# EAGLE design OSO-MISC-21-015 Temperature and Light Board (EAGLE 9.6.2)
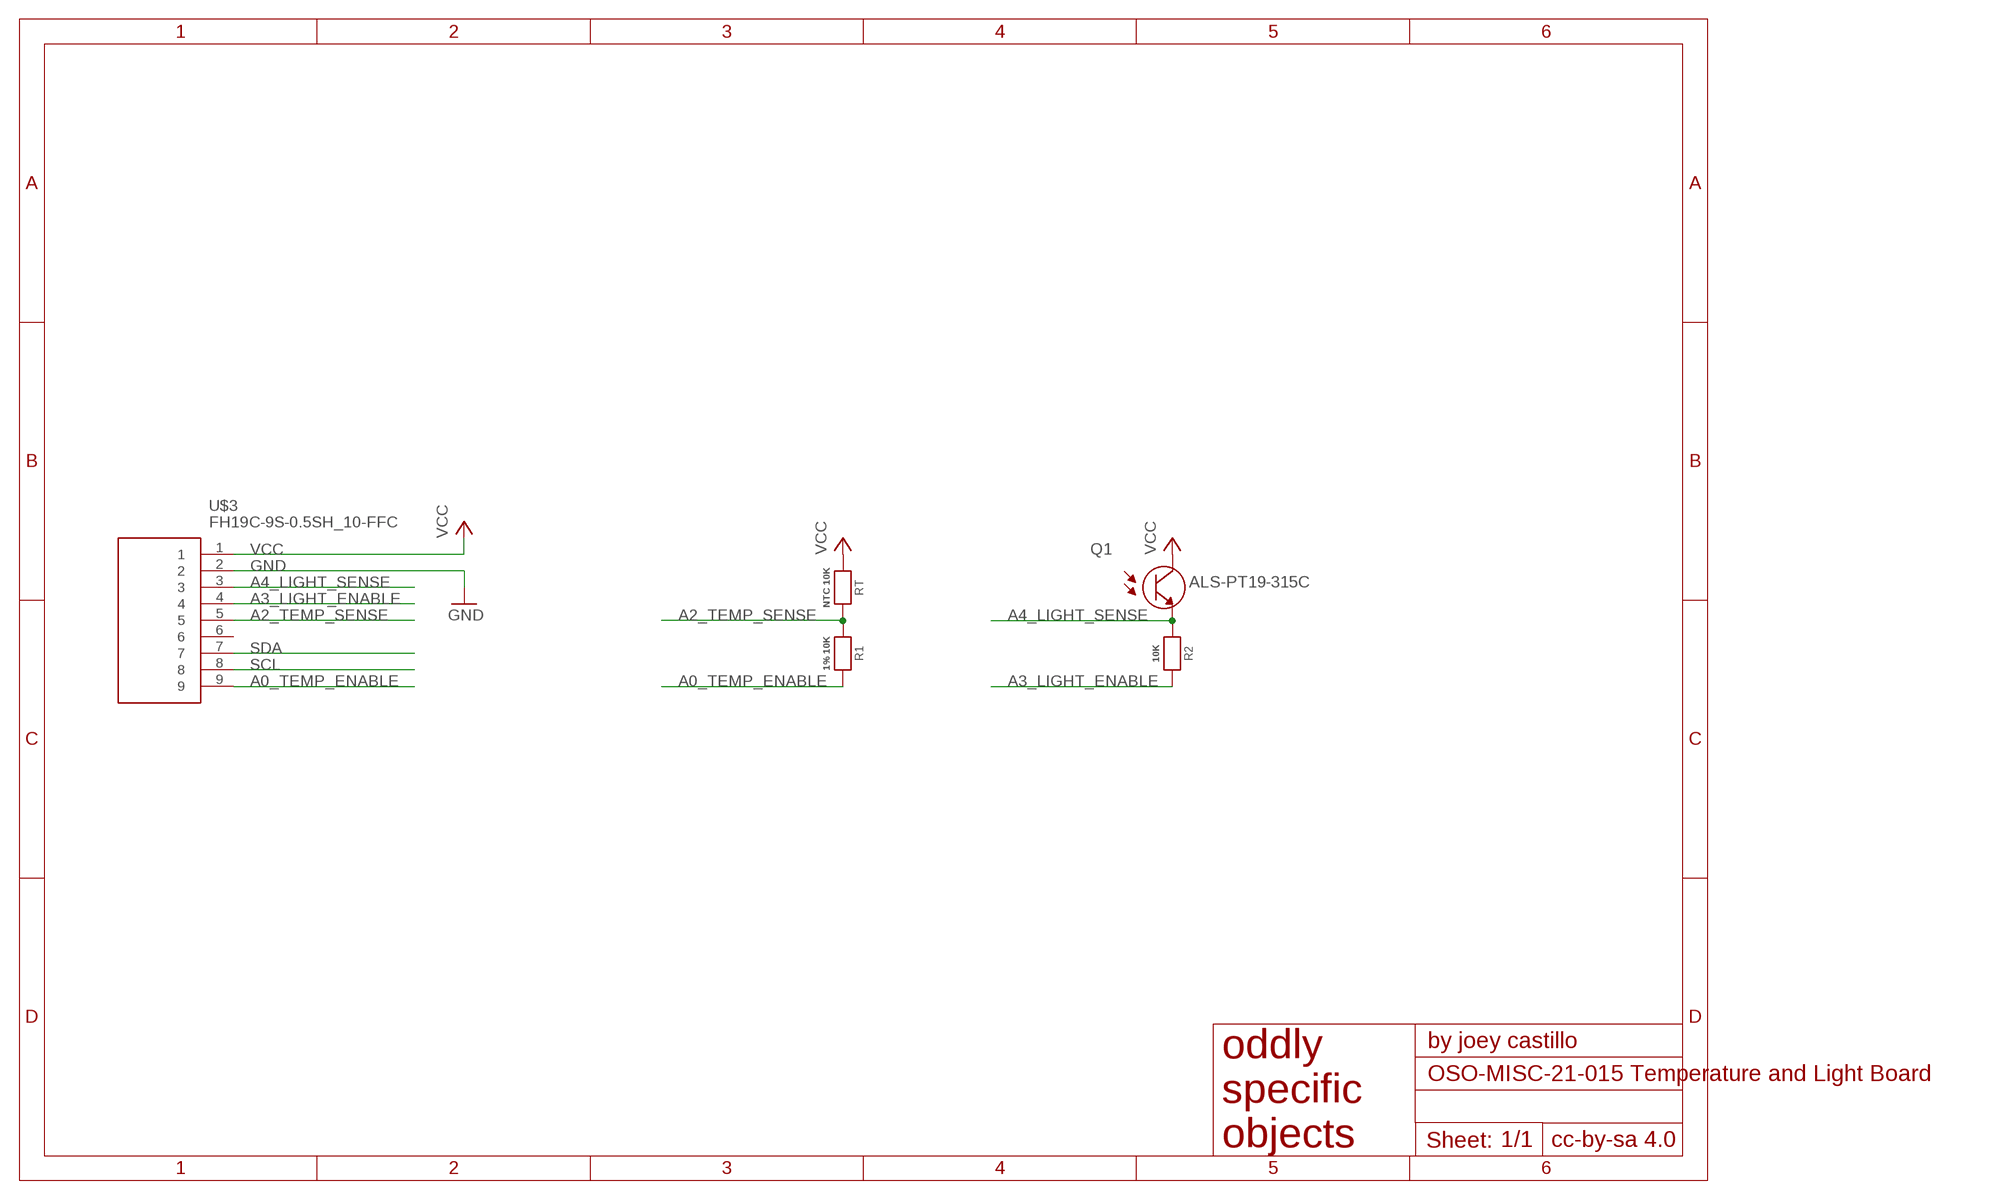
[diagram p0: schematic, sheet 1]

## Parts
Q1  ALS-PT19-315C  ALS-PT19-315C/L177/TR8REVERSEMOUNT  [XDCR_ALS-PT19-315C/L177/TR8_REVERSE]
R1  1% 10K  RESISTOR_0603MP  [_0603MP]
R2  10K  RESISTOR_0603MP  [_0603MP]
RT  NTC 10K  RESISTOR_0603  [_0603]
U$3  FH19C-9S-0.5SH_10-FFC  [FH19C9S05SH10-FFC]

## Nets
A0_TEMP_ENABLE: R1.2 U$3.9
A2_TEMP_SENSE: R1.1 RT.2 U$3.5
A3_LIGHT_ENABLE: R2.2 U$3.4
A4_LIGHT_SENSE: Q1.2(E) R2.1 U$3.3
GND [gnd]: U$3.2
SCL: U$3.8
SDA: U$3.7
VCC [power]: Q1.1(C) RT.1 U$3.1
Unconnected: U$3.6

## Library data of the parts
Q1 = ALS-PT19-315C_L177_TR8:ALS-PT19-315C/L177/TR8: Phototransistors 630nm 2-SMD, No Lead
R1 R2 RT = microbuilder:RESISTOR: Resistors For new designs, use the packages preceded by an '_' character since they are more reliable: The following footprints should be used on most boards: _0402 - Standard footprint for regular board layouts _0603 - Standard footprint for regular board layouts _0805 - Standard footprint for regular board layouts _1206 - Standard footprint for regular board layouts For extremely tight-pitch boards where space is at a premium, the following 'micro-pitch' footprints can be used (smaller pads, no silkscreen outline, etc.): _0402MP - Micro-pitch footprint for very dense/compact boards _0603MP - Micro-pitch footprint for very dense/compact boards _0805MP - Micro-pitch footprint for very dense/compact boards _1206MP - Micro-pitch footprint for very dense/compact boards
U$3 = FH19C-9S-0.5SH:FH19C-9S-0.5SH_10-FFC

## Net classes
0 default: width 0.203 mm
1 power: width 0.203 mm
2 gnd: width 0.203 mm

## Board
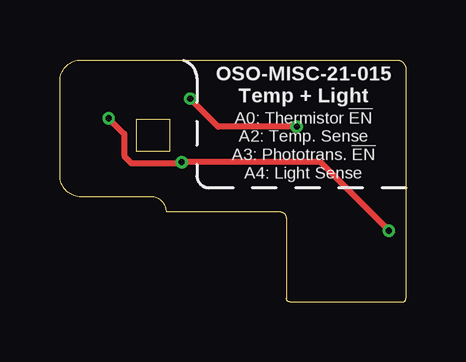
[diagram p1: board, top side]
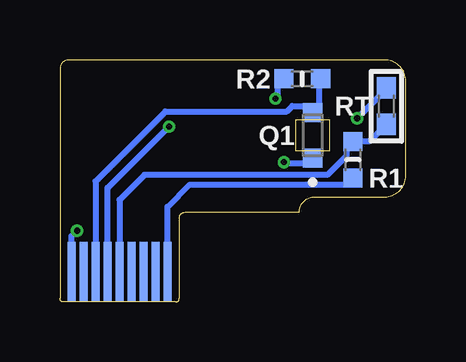
[diagram p2: board, bottom side, seen from below]

Size 14.43 x 10.1 mm. Coordinates in mm from the lower left corner, seen from the top.
Outline: 9.45,3.5 arc90 9.2,3.75 4.45,3.75 arc90 3.81,4.39 0.89,4.39 arc-90 0,5.28 0,9.21 arc-90 0.89,10.1 14.05,10.1 arc-90 14.43,9.72 14.43,3.5
Copper layers (1*16): Top 0.035559375mm / dielectric 1.6mm / Bottom 0.035559375mm
Design rules "oshpark-2layer *": minimum track width 6mil, minimum drill 10mil, track to track 6mil, track to pad 6mil, pad to pad 6mil, via to via 6mil, smd to smd 6mil, copper to edge 15mil, drill to drill 6mil, minimum pad ring 5mil, minimum via ring 5mil, stop-mask expansion 2.5mil, vias tented up to drill 12mil, thermal gap 10mil

### Footprints (pad centres in the part's own frame; a part is rotated, then mirrored left to right if it is on the bottom)
XDCR_ALS-PT19-315C/L177/TR8_REVERSE = smd 0.8 x 0.8: 1 -0.95,0; 2 0.95,0
_0603MP = smd 0.8 x 0.8: 1 -0.762,0; 2 0.762,0
_0603 = smd 0.9 x 0.8: 1 -0.762,0; 2 0.762,0
FH19C9S05SH10-FFC = smd 0.347 x 2.5 bottom: 1 2,-2.25; 2 1.5,-2.25; 3 1,-2.25; 4 0.5,-2.25; 5 0,-2.25; 6 -0.5,-2.25; 7 -1,-2.25; 8 -1.5,-2.25; 9 -2,-2.25

### Placement (x,y rotation side)
Q1  3.89,6.95 90 bottom
R1  2.21,5.94 270 bottom
R2  4.32,9.32 180 bottom
RT  0.81,8.17 270 bottom
U$3  11.94,3.5 0 top

### Tracks (layer width: path | path; a pad name or v marks a point on that pad's centre or on a via)
A0_TEMP_ENABLE
  Bottom 0.254: U$3.9 9.94,3.98 9.02,4.9 2.49,4.9 R1.2
A2_TEMP_SENSE
  Bottom 0.254: RT.2 1.52,6.7 R1.1 2.49,6.42 2.49,6.09 3.28,5.3 10.9,5.3 11.94,4.26 U$3.5
A3_LIGHT_ENABLE  (via drill 0.25)
  Top 0.254: v9.88,7.32 6.6,7.32 v5.44,8.49
  Bottom 0.254: U$3.4 12.44,4.76 v9.88,7.32 | v5.44,8.49 5.36,8.57 5.36,9.04 R2.2
A4_LIGHT_SENSE
  Bottom 0.254: U$3.3 12.94,5.04 10.02,7.96 4.96,7.96 4.73,8.18 3.89,8.18 | Q1.2 3.89,8.18 | R2.1 3.61,9.27 3.61,8.18 3.89,8.18
VCC  (via drill 0.25)
  Top 0.254: v2.03,7.67 2.68,7.02 2.68,6.09 2.98,5.8 5.05,5.8 v5.08,5.83 v5.08,5.84 10.86,5.84 v13.72,2.98
  Bottom 0.254: U$3.1 13.94,2.76 v13.72,2.98 | RT.1 0.81,8.89 v2.03,7.67 | Q1.1 3.89,5.8 5.04,5.8 v5.08,5.84

### Text on the board
tPlace: OSO-MISC-21-015 / Temp + Light | A0: Thermistor !EN / A2: Temp. Sense / A3: Phototrans. !EN / A4: Light Sense